# Altium project PeltierDrv_part.PrjPcb
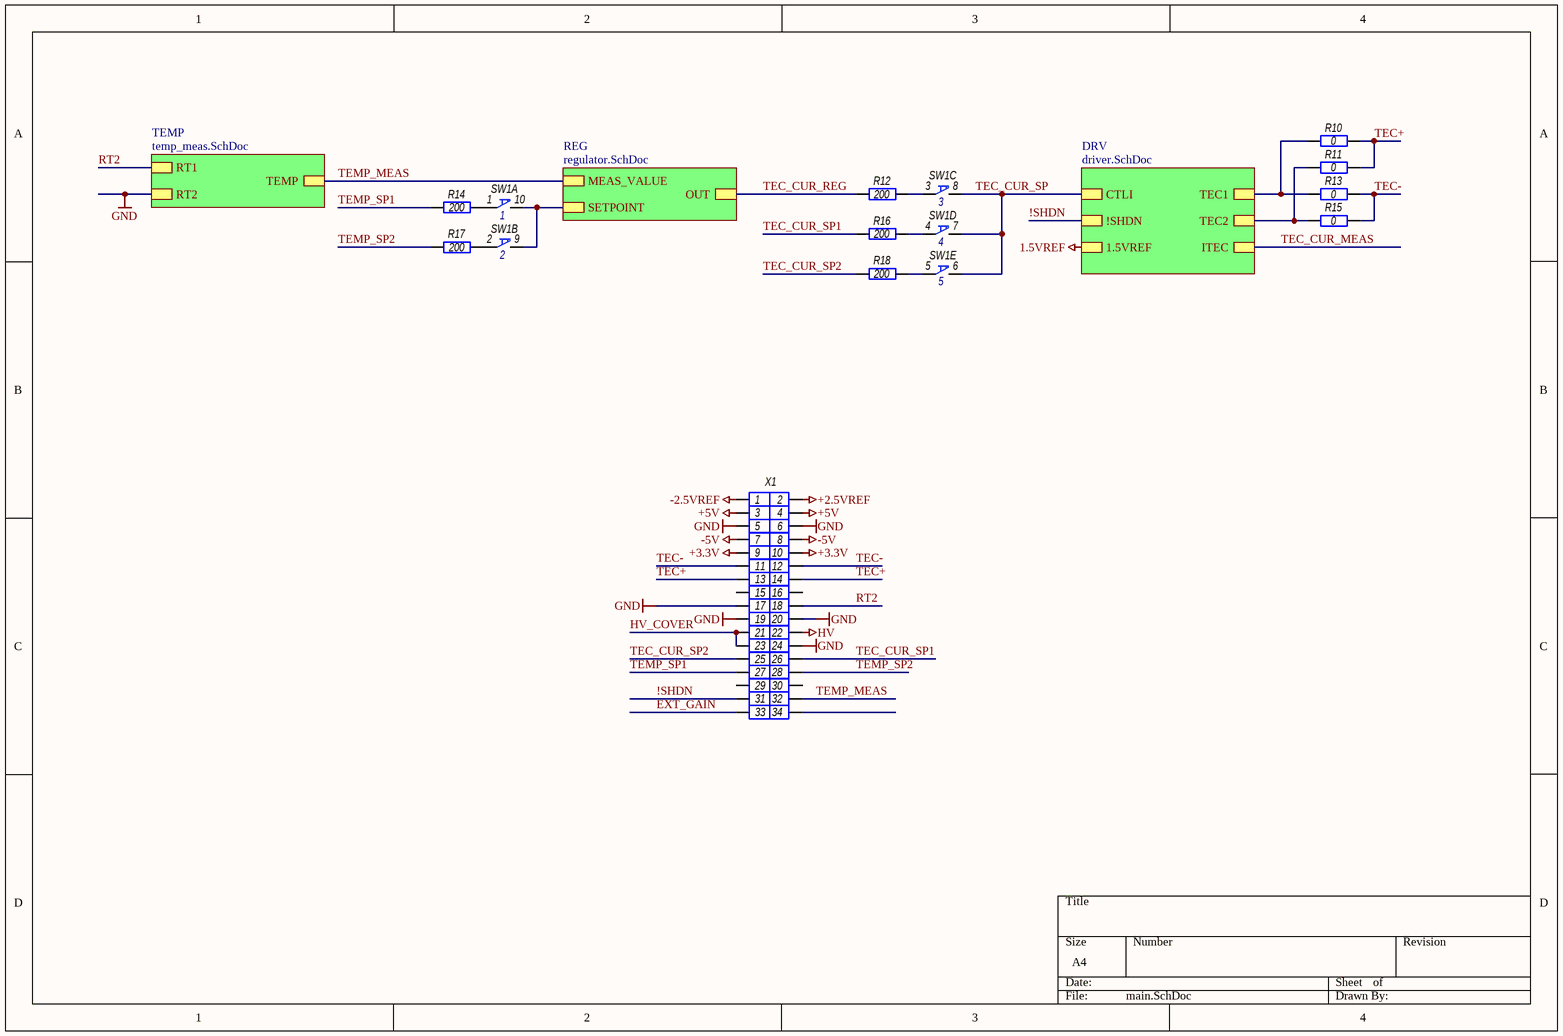
[diagram p0: main.SchDoc]
4 sheets, 53 parts. Net scope: hierarchical (ports join the sheet entries above them; power ports are global).
Board file: PeltierDrv_part.PcbDoc
Sheets:
  main.SchDoc
    DRV = driver.SchDoc
    TEMP = temp_meas.SchDoc
    REG = regulator.SchDoc

## Sheet main.SchDoc
size A4; SheetNumber: 1; SheetTotal: 4

### Parts
R10  0  [RES_0805]
R11  0  [RES_0805]
R12  200  [RES_0603]
R13  0  [RES_0805]
R14  200  [RES_0603]
R15  0  [RES_0805]
R16  200  [RES_0603]
R17  200  [RES_0603]
R18  200  [RES_0603]
SW1  ?  [SWD1-5]  (value not drawn)  (parts A,B,C,D,E of 5)
X1  ?  [BH-34]  (value not drawn)

### Sub-sheets
DRV = driver.SchDoc: TEC1, 1.5VREF, !SHDN, ITEC, CTLI, TEC2
REG = regulator.SchDoc: SETPOINT, MEAS_VALUE, OUT
TEMP = temp_meas.SchDoc: RT2, TEMP, RT1

### Nets
+2.5VREF: X1.2
+3.3V: X1.9 X1.10
+5V: X1.3 X1.4
-2.5VREF: X1.1
-5V: X1.7 X1.8
GND: X1.5 X1.6 X1.17 X1.19 X1.20 X1.24 ; sheet TEMP/RT2
HV: X1.22
!SHDN: X1.31 ; sheet DRV/!SHDN
EXT_GAIN: X1.33
HV_COVER: X1.21 X1.23
RT2: X1.18 ; sheet TEMP/RT1
TEC+: R10.2 R11.2 X1.13 X1.14
TEC-: R13.2 R15.2 X1.11 X1.12
TEC_CUR_REG: R12.1 ; sheet REG/OUT
TEC_CUR_SP: SW1.6 SW1.7 SW1.8 ; sheet DRV/CTLI
TEC_CUR_SP1: R16.1 X1.26
TEC_CUR_SP2: R18.1 X1.25
TEMP_MEAS: X1.32 ; sheet TEMP/TEMP, sheet REG/MEAS_VALUE
TEMP_SP1: R14.1 X1.27
TEMP_SP2: R17.1 X1.28
NetC2_2: R11.1 R15.1 ; sheet DRV/TEC2
NetR2_2: R10.1 R13.1 ; sheet DRV/TEC1
NetR12_2: R12.2 SW1.3
NetR14_2: R14.2 SW1.1
NetR16_2: R16.2 SW1.4
NetR17_2: R17.2 SW1.2
NetR18_2: R18.2 SW1.5
NetSW1_9: SW1.9 SW1.10 ; sheet REG/SETPOINT

Not connected (* = marked no-connect by the designer): X1 15 16 29 30 34

### Library data of the parts
R10-R18 = Resisitor: Резистор; ValueBOM: 0805 10k 0.125; ValueSCH: 10k; MarkPCB: 103
SW1 = SWD1-5: Переключатель 2 группы прямой: / SWD1-5; / DS1040-05RN; / DS1040-05BN; / BD05
X1 = Connector 17x2: ValueSCH: Model

## Sheet driver.SchDoc
size A4; SheetNumber: 2; SheetTotal: 4
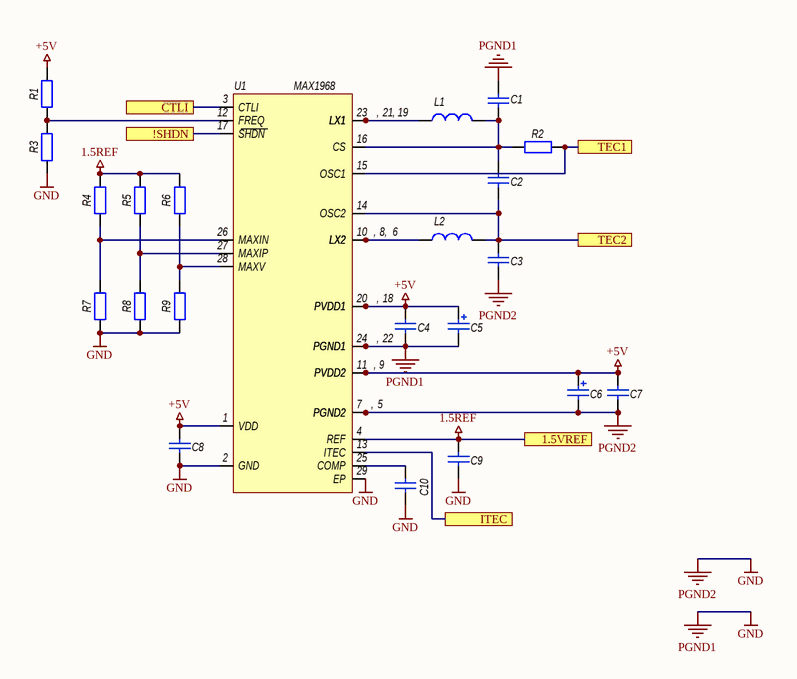
[diagram p1: driver.SchDoc]

### Parts
C1  0603 1u 6.3V  [CAP_0805]  (value not drawn)
C2  0805 10u 6.3V  [CAP_0805]  (value not drawn)
C3  0603 1u 6.3V  [CAP_0805]  (value not drawn)
C4  0603 1u 6.3V  [CAP_0805]  (value not drawn)
C5  47u 63V  [CAP 6.3x11]  (value not drawn)
C6  47u 63V  [CAP 6.3x11]  (value not drawn)
C7  0603 1u 6.3V  [CAP_0805]  (value not drawn)
C8  0603 1u 6.3V  [CAP_0805]  (value not drawn)
C9  0603 0.1u 6.3V  [CAP_0805]  (value not drawn)
C10  0603 1u 6.3V  [CAP_0805]  (value not drawn)
L1  LQH5BPN3R3NT0L  [IND_5050]  (value not drawn)
L2  LQH5BPN3R3NT0L  [IND_5050]  (value not drawn)
R1  0805 ?  [RES_0805]  (value not drawn)
R2  0805 50m  [RES_0805]  (value not drawn)
R3  0805 ?  [RES_0805]  (value not drawn)
R4  0805 ?  [RES_0805]  (value not drawn)
R5  0805 ?  [RES_0805]  (value not drawn)
R6  0805 ?  [RES_0805]  (value not drawn)
R7  0805 ?  [RES_0805]  (value not drawn)
R8  0805 ?  [RES_0805]  (value not drawn)
R9  0805 ?  [RES_0805]  (value not drawn)
U1  MAX1968  [TSSOP28+EP]

### Ports
1.5VREF, !SHDN, CTLI, ITEC, TEC1, TEC2

### Nets
1.5REF: C9.1 R4.2 R5.2 R6.2 U1.4(REF) ; port 1.5VREF
+5V: C4.1 C5.1 C6.1 C7.1 C8.1 R1.2 U1.1(VDD) U1.9(PVDD2) U1.11(PVDD2) U1.18(PVDD1) U1.20(PVDD1)
GND: C1.2 C3.2 C4.2 C5.2 C6.2 C7.2 C8.2 C9.2 C10.2 R3.1 R7.1 R8.1 R9.1 U1.2(GND) U1.5(PGND2) U1.7(PGND2) U1.22(PGND1) U1.24(PGND1) U1.29(EP)  [also labelled PGND1, PGND2]
!SHDN: U1.17(SHDN) ; port !SHDN
TEC_CUR_MEAS: U1.13(ITEC) ; port ITEC
TEC_CUR_SP: U1.3(CTLI) ; port CTLI
NetC1_1: C1.1 C2.1 L1.1 R2.1 U1.16(CS)
NetC2_2: C2.2 C3.1 L2.1 U1.14(OSC2) ; port TEC2
NetC10_1: C10.1 U1.25(COMP)
NetL1_2: L1.2 U1.19(LX1) U1.21(LX1) U1.23(LX1)
NetL2_2: L2.2 U1.6(LX2) U1.8(LX2) U1.10(LX2)
NetR1_1: R1.1 R3.2 U1.12(FREQ)
NetR2_2: R2.2 U1.15(OSC1) ; port TEC1
NetR4_1: R4.1 R7.2 U1.26(MAXIN)
NetR5_1: R5.1 R8.2 U1.27(MAXIP)
NetR6_1: R6.1 R9.2 U1.28(MAXV)

### Notes on the sheet
- (in symbol MAX1968) ,

### Library data of the parts
C1-C4 C7-C10 = Capacitor: Конденсатор
C5 C6 = CapacitorEl: Конденсатор электролитический; ValueBOM: 47u; ValueSCH: 47u 63V
L1 L2 = IND: Индуктивность
R1-R9 = Resisitor: Резистор
U1 = MAX1968: Драйвер пельтье

## Sheet temp_meas.SchDoc
size A4; SheetNumber: 3; SheetTotal: 4
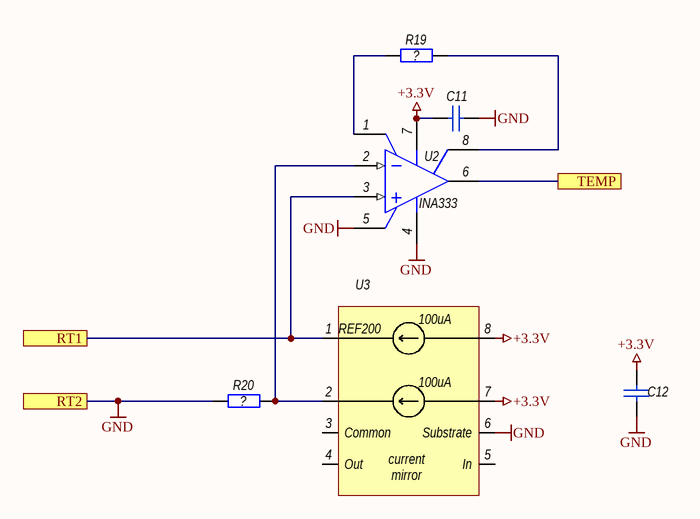
[diagram p2: temp_meas.SchDoc]

### Parts
C11  0603 1u 6.3V  [CAP_0805]  (value not drawn)
C12  0603 1u 6.3V  [CAP_0603]  (value not drawn)
R19  ?  [RES_0603]
R20  ?  [RES_0603]
U2  INA333  [MSOP-8]
U3  REF200  [SO8-150]

### Ports
RT1, RT2, TEMP

### Nets
+3.3V: C11.2 C12.2 U2.7(V+) U3.7 U3.8
GND: C11.1 C12.1 R20.1 U2.4(V-) U2.5(REF) U3.6(Substrate) ; port RT2
RT2: U2.3(IN+) U3.1 ; port RT1
TEMP_MEAS: U2.6(OUT) ; port TEMP
NetR19_1: R19.1 U2.1(RG)
NetR19_2: R19.2 U2.8(RG)
NetR20_2: R20.2 U2.2(IN-) U3.2

Not connected (* = marked no-connect by the designer): U3 3(Common) 4(Out) 5(In)

### Notes on the sheet
- (in symbol REF200) 100uA; current; mirror

### Library data of the parts
C11 C12 = Capacitor: Конденсатор
R19 R20 = Resisitor: Резистор
U2 = INA333: Инструментальный усилитель; ValueBOM: INA333; ValueSCH: INA333; MarkPCB: INA333; HelpURL: C:\Datasheets\INA333.pdf
U3 = REF200: Источник опорного тока; ValueBOM: REF200; ValueSCH: REF200; MarkPCB: REF200; HelpURL: C:\Datasheets\REF200.pdf

## Sheet regulator.SchDoc
size A4; SheetNumber: 4; SheetTotal: 4
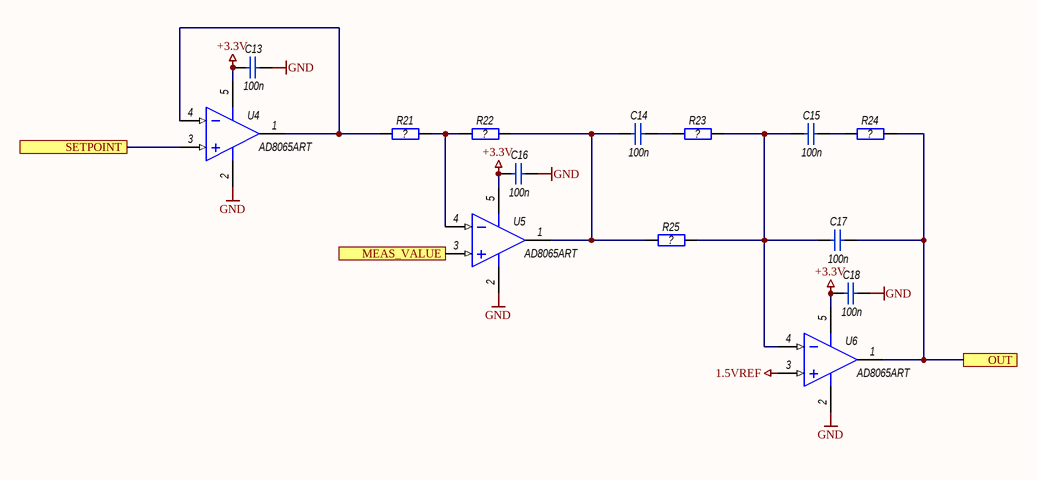
[diagram p3: regulator.SchDoc]

### Parts
C13  100n  [CAP_0805]
C14  100n  [CAP_0805]
C15  100n  [CAP_0805]
C16  100n  [CAP_0805]
C17  100n  [CAP_0805]
C18  100n  [CAP_0805]
R21  ?  [RES_0805]
R22  ?  [RES_0805]
R23  ?  [RES_0805]
R24  ?  [RES_0805]
R25  ?  [RES_0805]
U4  AD8065ART  [sot235]
U5  AD8065ART  [sot235]
U6  AD8065ART  [sot235]

### Ports
MEAS_VALUE, OUT, SETPOINT

### Nets
1.5VREF: U6.3(IN+)  [project net 1.5REF]
+3.3V: C13.1 C16.1 C18.1 U4.5(V+) U5.5(V+) U6.5(V+)
GND: C13.2 C16.2 C18.2 U4.2(V-) U5.2(V-) U6.2(V-)
TEC_CUR_REG: C17.2 R24.2 U6.1(OUT) ; port OUT
TEMP_MEAS: U5.3(IN+) ; port MEAS_VALUE
NetC14_1: C14.1 R22.2 R25.1 U5.1(OUT)
NetC14_2: C14.2 R23.1
NetC15_1: C15.1 C17.1 R23.2 R25.2 U6.4(IN-)
NetC15_2: C15.2 R24.1
NetR21_1: R21.1 U4.1(OUT) U4.4(IN-)
NetR21_2: R21.2 R22.1 U5.4(IN-)
NetSW1_9: U4.3(IN+) ; port SETPOINT

### Library data of the parts
C13-C18 = Capacitor: Конденсатор
R21-R25 = Resisitor: Резистор
U4-U6 = OPAMP SOT235: Операционный усилитель

## Nets that join several sheets
1.5REF: driver (5 pins), regulator (U6.3)
+3.3V: main (X1.9 X1.10), temp_meas (5 pins), regulator (6 pins)
+5V: main (X1.3 X1.4), driver (11 pins)
GND: main (6 pins), driver (19 pins), temp_meas (6 pins), regulator (6 pins)
!SHDN: main (X1.31), driver (U1.17)
NetC2_2: main (R11.1 R15.1), driver (C2.2 C3.1 L2.1 U1.14)
NetR2_2: main (R10.1 R13.1), driver (R2.2 U1.15)
NetSW1_9: main (SW1.9 SW1.10), regulator (U4.3)
RT2: main (X1.18), temp_meas (U2.3 U3.1)
TEC_CUR_REG: main (R12.1), regulator (C17.2 R24.2 U6.1)
TEC_CUR_SP: main (SW1.6 SW1.7 SW1.8), driver (U1.3)
TEMP_MEAS: main (X1.32), temp_meas (U2.6), regulator (U5.3)